# Altium schematic sheet LED.SchDoc
size A4
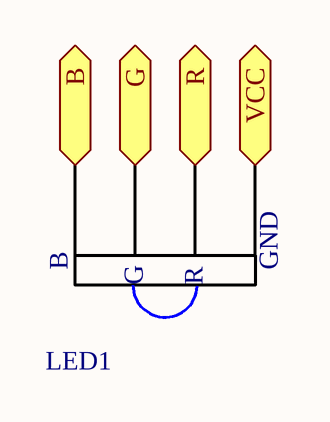
[diagram p0: LED.SchDoc]

## Parts
LED1  LED 4p  [4p 2.54 pitch LED]  (value not drawn)

## Ports
B (out), G (out), R (out), VCC (in)

## Nets
B: LED1.4 ; port B
G: LED1.3 ; port G
R: LED1.2 ; port R
VCC: LED1.1 ; port VCC

## Notes on the sheet
- (in symbol LED 4p) B; GND; G; R